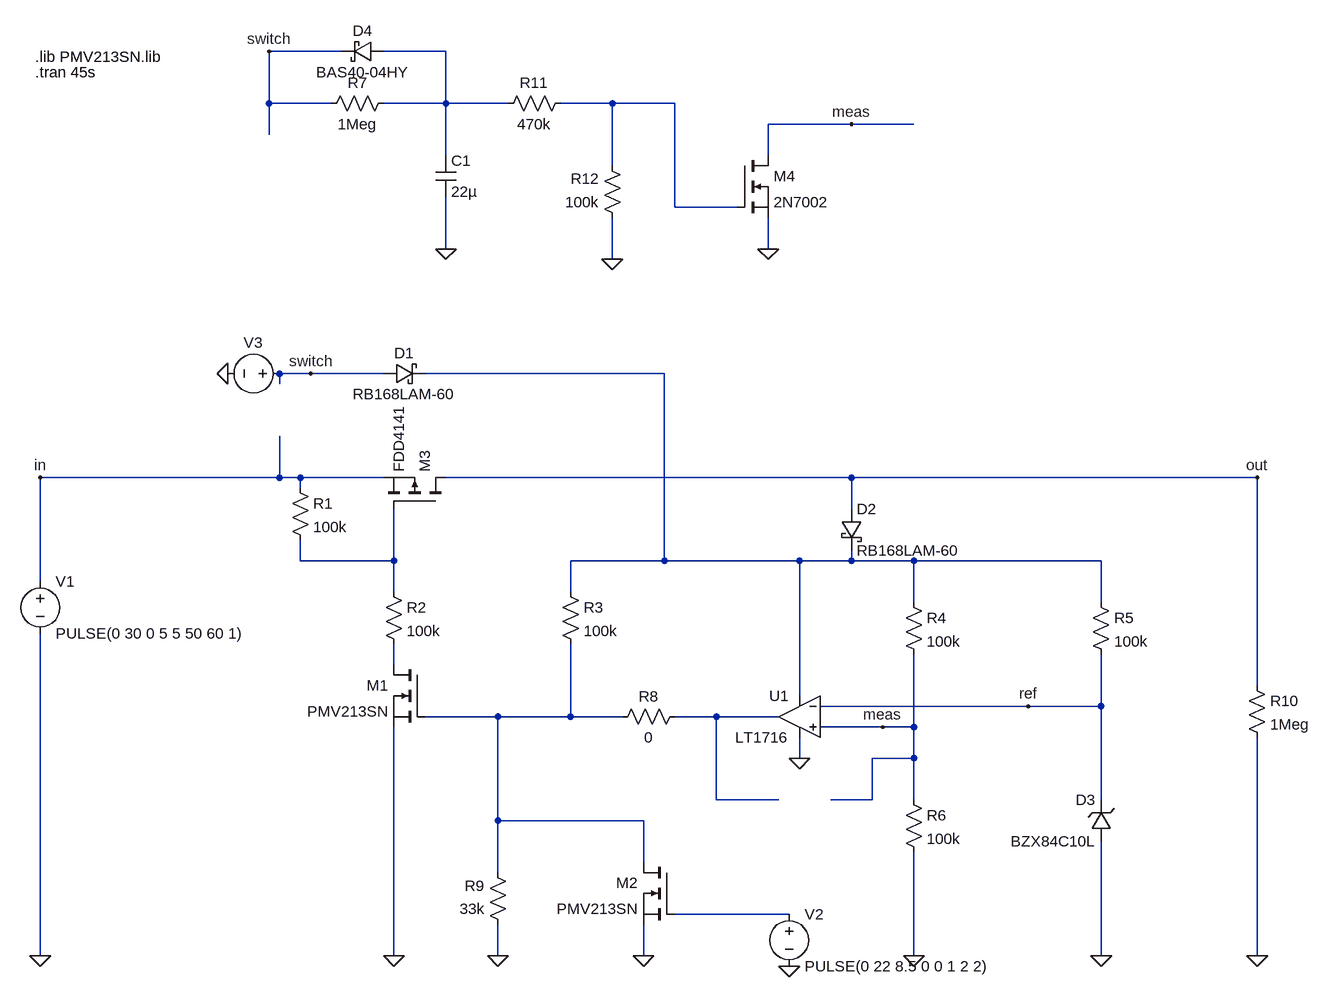
[diagram p0: schematic On_Off_ctrl.asc]
On_Off_ctrl.asc, the LTspice schematic file:
Version 4
SHEET 1 1832 760
WIRE 336 -688 224 -688
WIRE 496 -688 400 -688
WIRE 224 -608 224 -688
WIRE 320 -608 224 -608
WIRE 496 -608 496 -688
WIRE 496 -608 400 -608
WIRE 592 -608 496 -608
WIRE 752 -608 672 -608
WIRE 848 -608 752 -608
WIRE 1120 -576 992 -576
WIRE 1216 -576 1120 -576
WIRE 224 -560 224 -608
WIRE 496 -528 496 -608
WIRE 992 -528 992 -576
WIRE 752 -512 752 -608
WIRE 848 -448 848 -608
WIRE 944 -448 848 -448
WIRE 496 -384 496 -464
WIRE 992 -384 992 -432
WIRE 752 -368 752 -432
WIRE 288 -192 240 -192
WIRE 400 -192 288 -192
WIRE 832 -192 464 -192
WIRE 240 -176 240 -192
WIRE 240 -32 240 -96
WIRE 240 -32 -128 -32
WIRE 272 -32 240 -32
WIRE 400 -32 272 -32
WIRE 1120 -32 496 -32
WIRE 1744 -32 1120 -32
WIRE 272 -16 272 -32
WIRE 1120 16 1120 -32
WIRE 272 96 272 64
WIRE 416 96 416 16
WIRE 416 96 272 96
WIRE 832 96 832 -192
WIRE 832 96 688 96
WIRE 1040 96 832 96
WIRE 1120 96 1120 80
WIRE 1120 96 1040 96
WIRE 1216 96 1120 96
WIRE 1504 96 1216 96
WIRE -128 128 -128 -32
WIRE 416 144 416 96
WIRE 688 144 688 96
WIRE 1216 160 1216 96
WIRE 1504 160 1504 96
WIRE 416 256 416 224
WIRE 1744 288 1744 -32
WIRE 1040 304 1040 96
WIRE 1392 320 1072 320
WIRE 1504 320 1504 240
WIRE 1504 320 1392 320
WIRE 576 336 464 336
WIRE 688 336 688 224
WIRE 688 336 576 336
WIRE 768 336 688 336
WIRE 912 336 848 336
WIRE 1008 336 912 336
WIRE 1168 352 1072 352
WIRE 1216 352 1216 240
WIRE 1216 352 1168 352
WIRE 1040 400 1040 368
WIRE 1216 400 1216 352
WIRE 1216 400 1152 400
WIRE 912 464 912 336
WIRE 1008 464 912 464
WIRE 1152 464 1152 400
WIRE 1152 464 1088 464
WIRE 1216 464 1216 400
WIRE 1504 464 1504 320
WIRE 576 496 576 336
WIRE 800 496 576 496
WIRE 800 560 800 496
WIRE 576 576 576 496
WIRE 1024 640 848 640
WIRE -128 704 -128 208
WIRE 416 704 416 352
WIRE 576 704 576 656
WIRE 800 704 800 656
WIRE 1216 704 1216 544
WIRE 1504 704 1504 528
WIRE 1744 704 1744 368
FLAG 576 704 0
FLAG 1040 400 0
FLAG 1216 704 0
FLAG 1504 704 0
FLAG 800 704 0
FLAG 1024 720 0
FLAG 1744 704 0
FLAG 416 704 0
FLAG -128 704 0
FLAG 160 -192 0
FLAG 1744 -32 out
FLAG -128 -32 in
FLAG 288 -192 switch
FLAG 1392 320 ref
FLAG 1168 352 meas
FLAG 992 -384 0
FLAG 496 -384 0
FLAG 224 -688 switch
FLAG 1120 -576 meas
FLAG 752 -368 0
SYMBOL voltage -128 112 R0
WINDOW 123 0 0 Left 0
WINDOW 39 0 0 Left 0
SYMATTR InstName V1
SYMATTR Value PULSE(0 30 0 5 5 50 60 1)
SYMBOL res 256 -32 R0
SYMATTR InstName R1
SYMATTR Value 100k
SYMBOL res 400 128 R0
SYMATTR InstName R2
SYMATTR Value 100k
SYMBOL res 672 128 R0
SYMATTR InstName R3
SYMATTR Value 100k
SYMBOL res 1200 144 R0
SYMATTR InstName R4
SYMATTR Value 100k
SYMBOL res 1488 144 R0
SYMATTR InstName R5
SYMATTR Value 100k
SYMBOL res 1200 448 R0
SYMATTR InstName R6
SYMATTR Value 100k
SYMBOL res 864 320 R90
WINDOW 0 0 56 VBottom 2
WINDOW 3 32 56 VTop 2
SYMATTR InstName R8
SYMATTR Value 0
SYMBOL res 592 672 R180
WINDOW 0 36 76 Left 2
WINDOW 3 36 40 Left 2
SYMATTR InstName R9
SYMATTR Value 33k
SYMBOL nmos 464 256 M0
SYMATTR InstName M1
SYMATTR Value PMV213SN
SYMATTR Prefix X
SYMBOL nmos 848 560 M0
SYMATTR InstName M2
SYMATTR Value PMV213SN
SYMATTR Prefix X
SYMBOL pmos 496 16 M270
SYMATTR InstName M3
SYMATTR Value FDD4141
SYMBOL schottky 400 -176 R270
WINDOW 0 32 32 VTop 2
WINDOW 3 0 32 VBottom 2
SYMATTR InstName D1
SYMATTR Value RB168LAM-60
SYMATTR Description Diode
SYMATTR Type diode
SYMBOL schottky 1104 16 R0
SYMATTR InstName D2
SYMATTR Value RB168LAM-60
SYMATTR Description Diode
SYMATTR Type diode
SYMBOL Comparators\\LT1716 1040 336 M0
SYMATTR InstName U1
SYMBOL zener 1520 528 R180
WINDOW 0 24 64 Left 2
WINDOW 3 24 0 Left 2
SYMATTR InstName D3
SYMATTR Value BZX84C10L
SYMBOL voltage 1024 624 R0
WINDOW 123 0 0 Left 0
WINDOW 39 0 0 Left 0
SYMATTR InstName V2
SYMATTR Value PULSE(0 22 8.5 0 0 1 2 2)
SYMBOL res 1728 272 R0
SYMATTR InstName R10
SYMATTR Value 1Meg
SYMBOL voltage 256 -192 R90
WINDOW 0 -32 56 VBottom 2
WINDOW 3 32 56 Invisible 2
WINDOW 123 0 0 Left 0
WINDOW 39 0 0 Left 0
SYMATTR InstName V3
SYMATTR Value PWL(0 0 7.5 0 7.51 22 8.5 22 8.51 0 9.5 0 9.51 22 10.5 22 10.51 0 11.5 0 11.51 22 12.5 22 12.51 0 13.50 0 13.51 30 33 30 33.1 0)
SYMBOL nmos 944 -528 R0
SYMATTR InstName M4
SYMATTR Value 2N7002
SYMBOL res 416 -624 R90
WINDOW 0 0 56 VBottom 2
WINDOW 3 32 56 VTop 2
SYMATTR InstName R7
SYMATTR Value 1Meg
SYMBOL cap 480 -528 R0
SYMATTR InstName C1
SYMATTR Value 22µ
SYMBOL schottky 400 -704 R90
WINDOW 0 0 32 VBottom 2
WINDOW 3 32 32 VTop 2
SYMATTR InstName D4
SYMATTR Value BAS40-04HY
SYMATTR Description Diode
SYMATTR Type diode
SYMBOL res 688 -624 R90
WINDOW 0 0 56 VBottom 2
WINDOW 3 32 56 VTop 2
SYMATTR InstName R11
SYMATTR Value 470k
SYMBOL res 768 -416 R180
WINDOW 0 36 76 Left 2
WINDOW 3 36 40 Left 2
SYMATTR InstName R12
SYMATTR Value 100k
TEXT -136 -680 Left 2 !.lib PMV213SN.lib
TEXT -136 -656 Left 2 !.tran 45s

The netlist it stands for:
* On_Off_ctrl.asc
V1 in 0 PULSE(0 30 0 5 5 50 60 1)
R1 in N004 100k
R2 N004 N005 100k
R3 N003 N006 100k
R4 N003 meas 100k
R5 N003 ref 100k
R6 meas 0 100k
R8 N007 N006 0
R9 0 N006 33k
XM1 N005 N006 0 PMV213SN  ; pins D G S
XM2 N006 N008 0 PMV213SN  ; pins D G S
M3 out N004 in in FDD4141
D1 switch N003 RB168LAM-60
D2 out N003 RB168LAM-60
XU1 meas ref N003 0 N007 LT1716  ; pins In+ In- V+ V- OUT
D3 0 ref BZX84C10L
V2 N008 0 PULSE(0 22 8.5 0 0 1 2 2)
R10 out 0 1Meg
V3 switch 0 PWL(0 0 7.5 0 7.51 22 8.5 22 8.51 0 9.5 0 9.51 22 10.5 22 10.51 0 11.5 0 11.51 22 12.5 22 12.51 0 13.50 0 13.51 30 33 30 33.1 0)
M4 meas N002 0 0 2N7002
R7 N001 switch 1Meg
C1 N001 0 22µ
D4 N001 switch BAS40-04HY
R11 N002 N001 470k
R12 0 N002 100k
.model D D
.lib standard.dio
.model NMOS NMOS
.model PMOS PMOS
.lib standard.mos
.lib PMV213SN.lib
.tran 45s
.lib LTC1.lib
.backanno
.end